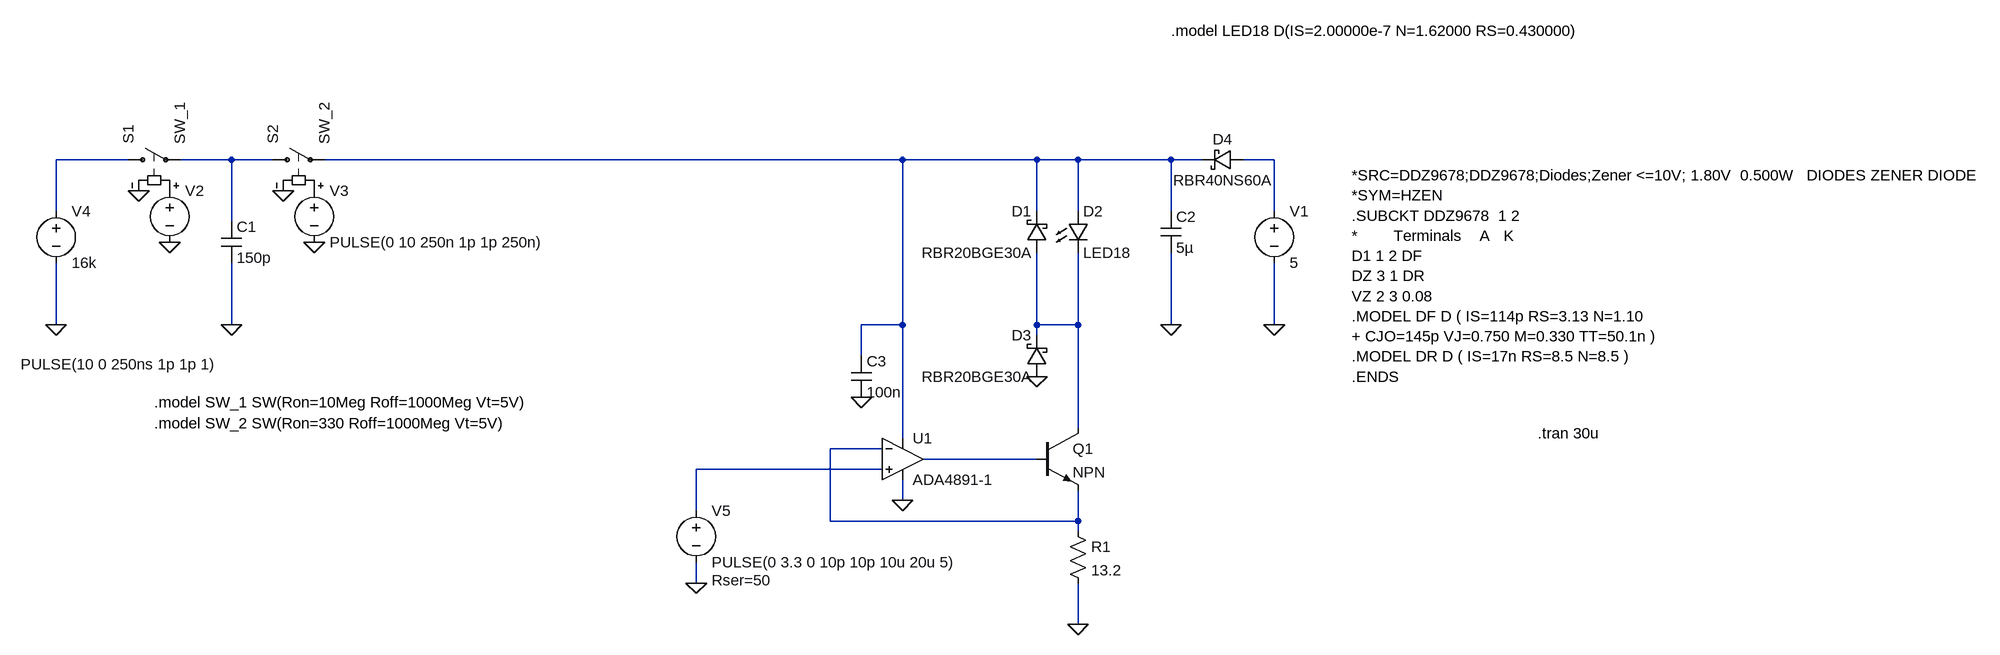
[diagram p0: schematic Schematic.asc]
Schematic.asc, the LTspice schematic file:
Version 4
SHEET 1 1780 788
WIRE -1136 48 -1248 48
WIRE -976 48 -1056 48
WIRE -912 48 -976 48
WIRE 64 48 -832 48
WIRE 272 48 64 48
WIRE 336 48 272 48
WIRE 480 48 336 48
WIRE 528 48 480 48
WIRE 640 48 592 48
WIRE -1248 128 -1248 48
WIRE 272 128 272 48
WIRE 336 128 336 48
WIRE 480 128 480 48
WIRE 640 128 640 48
WIRE -976 144 -976 48
WIRE -1248 304 -1248 208
WIRE -976 304 -976 208
WIRE 64 304 64 48
WIRE 64 304 0 304
WIRE 272 304 272 192
WIRE 336 304 336 192
WIRE 336 304 272 304
WIRE 480 304 480 192
WIRE 640 304 640 208
WIRE 272 320 272 304
WIRE 0 352 0 304
WIRE 336 464 336 304
WIRE 64 480 64 304
WIRE 32 496 -48 496
WIRE 272 512 96 512
WIRE 32 528 -256 528
WIRE 64 576 64 544
WIRE -256 592 -256 528
WIRE -48 608 -48 496
WIRE 336 608 336 560
WIRE 336 608 -48 608
WIRE 336 624 336 608
WIRE -256 704 -256 672
WIRE 336 768 336 704
FLAG -896 96 0
FLAG -848 176 0
FLAG -1072 176 0
FLAG -1120 96 0
FLAG -976 304 0
FLAG -1248 304 0
FLAG 272 384 0
FLAG 480 304 0
FLAG 336 768 0
FLAG 64 576 0
FLAG 0 416 0
FLAG 640 304 0
FLAG -256 704 0
SYMBOL LED 320 128 R0
SYMATTR InstName D2
SYMATTR Value LED18
SYMBOL schottky 288 192 R180
WINDOW 0 24 64 Left 2
WINDOW 3 24 0 Left 2
SYMATTR InstName D1
SYMATTR Value RBR20BGE30A
SYMBOL sw -1152 48 R270
SYMATTR InstName S1
SYMATTR Value SW_1
SYMBOL sw -928 48 R270
SYMATTR InstName S2
SYMATTR Value SW_2
SYMBOL cap -992 144 R0
SYMATTR InstName C1
SYMATTR Value 150p
SYMBOL voltage -1072 80 R0
WINDOW 3 -231 285 Left 2
WINDOW 123 0 0 Left 0
WINDOW 39 0 0 Left 0
SYMATTR Value PULSE(10 0 250ns 1p 1p 1)
SYMATTR InstName V2
SYMBOL voltage -848 80 R0
WINDOW 123 0 0 Left 0
WINDOW 39 0 0 Left 0
SYMATTR InstName V3
SYMATTR Value PULSE(0 10 250n 1p 1p 250n)
SYMBOL voltage -1248 112 R0
WINDOW 123 0 0 Left 0
WINDOW 39 0 0 Left 0
SYMATTR InstName V4
SYMATTR Value 16k
SYMBOL cap 464 128 R0
SYMATTR InstName C2
SYMATTR Value 5µ
SYMATTR SpiceLine V=5 Rser=4m
SYMBOL npn 272 464 R0
SYMATTR InstName Q1
SYMBOL res 320 608 R0
SYMATTR InstName R1
SYMATTR Value 13.2
SYMBOL OpAmps\\ADA4891-1 64 448 R0
SYMATTR InstName U1
SYMBOL cap -16 352 R0
SYMATTR InstName C3
SYMATTR Value 100n
SYMBOL voltage 640 112 R0
WINDOW 123 0 0 Left 0
WINDOW 39 0 0 Left 0
SYMATTR InstName V1
SYMATTR Value 5
SYMBOL voltage -256 576 R0
WINDOW 123 0 0 Left 0
WINDOW 39 24 124 Left 2
SYMATTR SpiceLine Rser=50
SYMATTR InstName V5
SYMATTR Value PULSE(0 3.3 0 10p 10p 10u 20u 5)
SYMBOL schottky 288 384 R180
WINDOW 0 24 64 Left 2
WINDOW 3 24 0 Left 2
SYMATTR InstName D3
SYMATTR Value RBR20BGE30A
SYMBOL schottky 592 32 R90
WINDOW 0 0 32 VBottom 2
WINDOW 3 32 32 VTop 2
SYMATTR InstName D4
SYMATTR Value RBR40NS60A
SYMATTR Description Diode
SYMATTR Type diode
TEXT 480 -152 Left 2 !.model LED18 D(IS=2.00000e-7 N=1.62000 RS=0.430000)
TEXT 1048 472 Left 2 !.tran 30u
TEXT -1096 424 Left 2 !.model SW_1 SW(Ron=10Meg Roff=1000Meg Vt=5V)
TEXT -1096 456 Left 2 !.model SW_2 SW(Ron=330 Roff=1000Meg Vt=5V)
TEXT 760 72 Left 2 !*SRC=DDZ9678;DDZ9678;Diodes;Zener <=10V; 1.80V  0.500W   DIODES ZENER DIODE\n*SYM=HZEN\n.SUBCKT DDZ9678  1 2\n*        Terminals    A   K\nD1 1 2 DF\nDZ 3 1 DR\nVZ 2 3 0.08\n.MODEL DF D ( IS=114p RS=3.13 N=1.10\n+ CJO=145p VJ=0.750 M=0.330 TT=50.1n )\n.MODEL DR D ( IS=17n RS=8.5 N=8.5 )\n.ENDS

The netlist it stands for:
* Schematic.asc
D2 N003 N005 LED18
D1 N005 N003 RBR20BGE30A
S1 N001 N002 P001 0 SW_1
S2 N002 N003 P002 0 SW_2
C1 N002 0 150p
V2 P001 0 PULSE(10 0 250ns 1p 1p 1)
V3 P002 0 PULSE(0 10 250n 1p 1p 250n)
V4 N001 0 16k
C2 N003 0 5µ V=5 Rser=4m
Q1 N005 N007 N006 0 NPN
R1 N006 0 13.2
XU1 N008 N006 N003 0 N007 ADA4891-1  ; pins In+ In- V+ V- OUT
C3 N003 0 100n
V1 N004 0 5
V5 N008 0 PULSE(0 3.3 0 10p 10p 10u 20u 5) Rser=50
D3 0 N005 RBR20BGE30A
D4 N004 N003 RBR40NS60A
.model D D
.lib standard.dio
.model NPN NPN
.model PNP PNP
.lib standard.bjt
.model LED18 D(IS=2.00000e-7 N=1.62000 RS=0.430000)
.tran 30u
.model SW_1 SW(Ron=10Meg Roff=1000Meg Vt=5V)
.model SW_2 SW(Ron=330 Roff=1000Meg Vt=5V)
*SRC=DDZ9678;DDZ9678;Diodes;Zener <=10V; 1.80V  0.500W   DIODES ZENER DIODE
*SYM=HZEN
.SUBCKT DDZ9678  1 2
*        Terminals    A   K
D1 1 2 DF
DZ 3 1 DR
VZ 2 3 0.08
.MODEL DF D ( IS=114p RS=3.13 N=1.10
+ CJO=145p VJ=0.750 M=0.330 TT=50.1n )
.MODEL DR D ( IS=17n RS=8.5 N=8.5 )
.ENDS
.backanno
.end